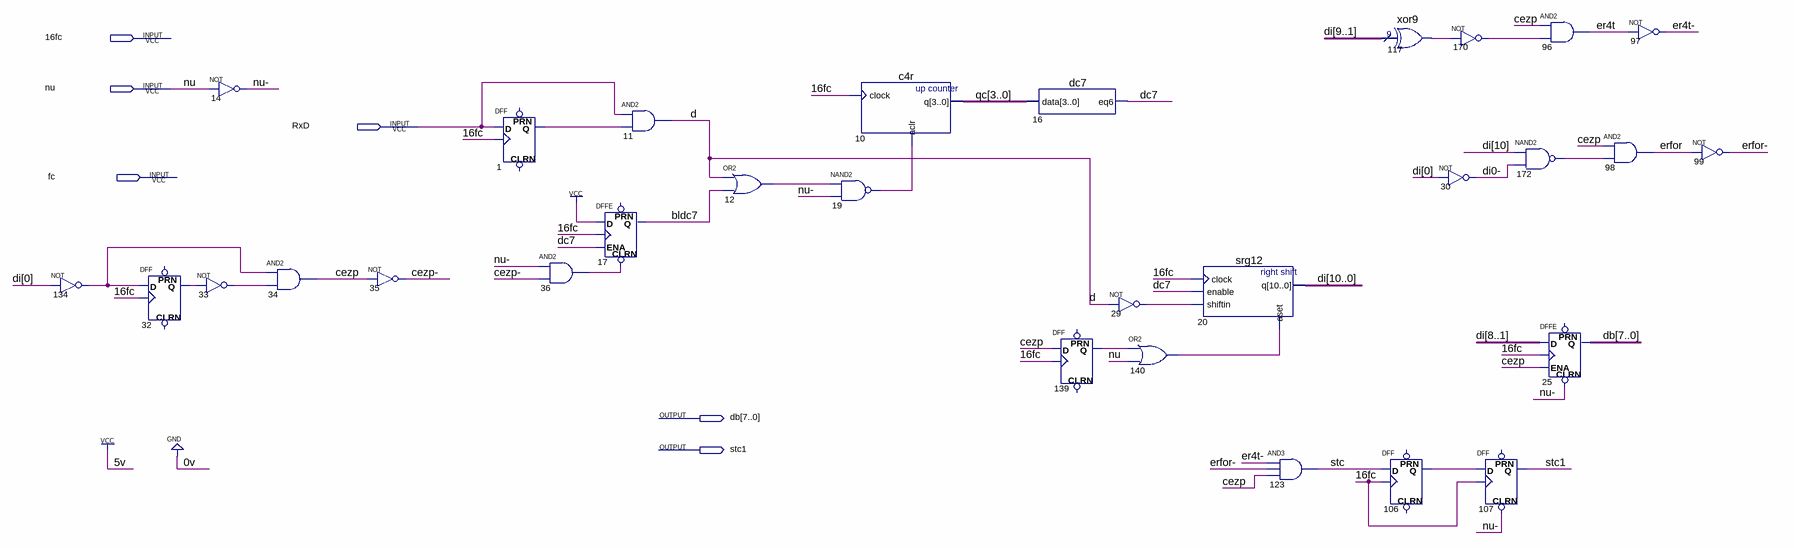
[diagram p0: schematic sheet]
// Quartus schematic sim2.bdf as structural Verilog: 30 symbols, 6 pins
module sim2 (
  input  \16fc ,
  input  nu,
  input  RxD,
  input  fc,
  output [7:0] db,
  output stc1
);

  wire bldc7, cezp, \cezp- , d, dc7, \di0- , er4t, \er4t- , erfor, \erfor- , n1_q, n12_out, n19_out, n29_out,
       n32_q, n33_out, n36_out, n106_q, n117_result, n134_out, n139_q, n140_out, n170_out, n172_out, \nu- ,
       stc;
  wire [3:0] qc;
  wire [10:0] di;

  not u_134 (n134_out, di[0]);
  DFF u_32 (.CLK(\16fc ), .D(n134_out), .Q(n32_q));  // open: CLRN, PRN
  not u_14 (\nu- , nu);
  not u_33 (n33_out, n32_q);
  and u_34 (cezp, n134_out, n33_out);
  not u_35 (\cezp- , cezp);
  DFF u_1 (.CLK(\16fc ), .D(RxD), .Q(n1_q));  // open: CLRN, PRN
  and u_36 (n36_out, \nu- , \cezp- );
  and u_11 (d, RxD, n1_q);
  DFFE u_17 (.CLRN(n36_out), .D(1'b1), .CLK(\16fc ), .ENA(dc7), .Q(bldc7));  // open: PRN
  or u_12 (n12_out, d, bldc7);
  c4r u_10 (.clock(\16fc ), .aclr(n19_out), .q(qc));
  nand u_19 (n19_out, n12_out, \nu- );
  dc7 u_16 (.data(qc), .eq6(dc7));
  DFF u_139 (.CLK(\16fc ), .D(cezp), .Q(n139_q));  // open: CLRN, PRN
  not u_29 (n29_out, d);
  or u_140 (n140_out, n139_q, nu);
  srg12 u_20 (.clock(\16fc ), .enable(dc7), .shiftin(n29_out), .aset(n140_out), .q(di));
  and u_123 (stc, \er4t- , \erfor- , cezp);
  xor9 u_117 (.data(di[9:1]), .result(n117_result));
  DFF u_106 (.CLK(\16fc ), .D(stc), .Q(n106_q));  // open: CLRN, PRN
  not u_170 (n170_out, n117_result);
  not u_30 (\di0- , di[0]);
  DFF u_107 (.CLRN(\nu- ), .CLK(\16fc ), .D(n106_q), .Q(stc1));  // open: PRN
  nand u_172 (n172_out, di[10], \di0- );
  and u_96 (er4t, cezp, n170_out);
  DFFE u_25[7:0] (.CLRN(\nu- ), .D(di[8:1]), .CLK(\16fc ), .ENA(cezp), .Q(db));  // open: PRN
  not u_97 (\er4t- , er4t);
  and u_98 (erfor, cezp, n172_out);
  not u_99 (\erfor- , erfor);
endmodule
